# Altium schematic sheet nRF-MCU.SchDoc: =ProjectTitle
size A3; Author: Z. Peterson; Organization: NWES LLC; Address1: 111 SW 5th Ave, STE 3150; Address2: Portland, OR 97204; SheetNumber: 1; SheetTotal: 1
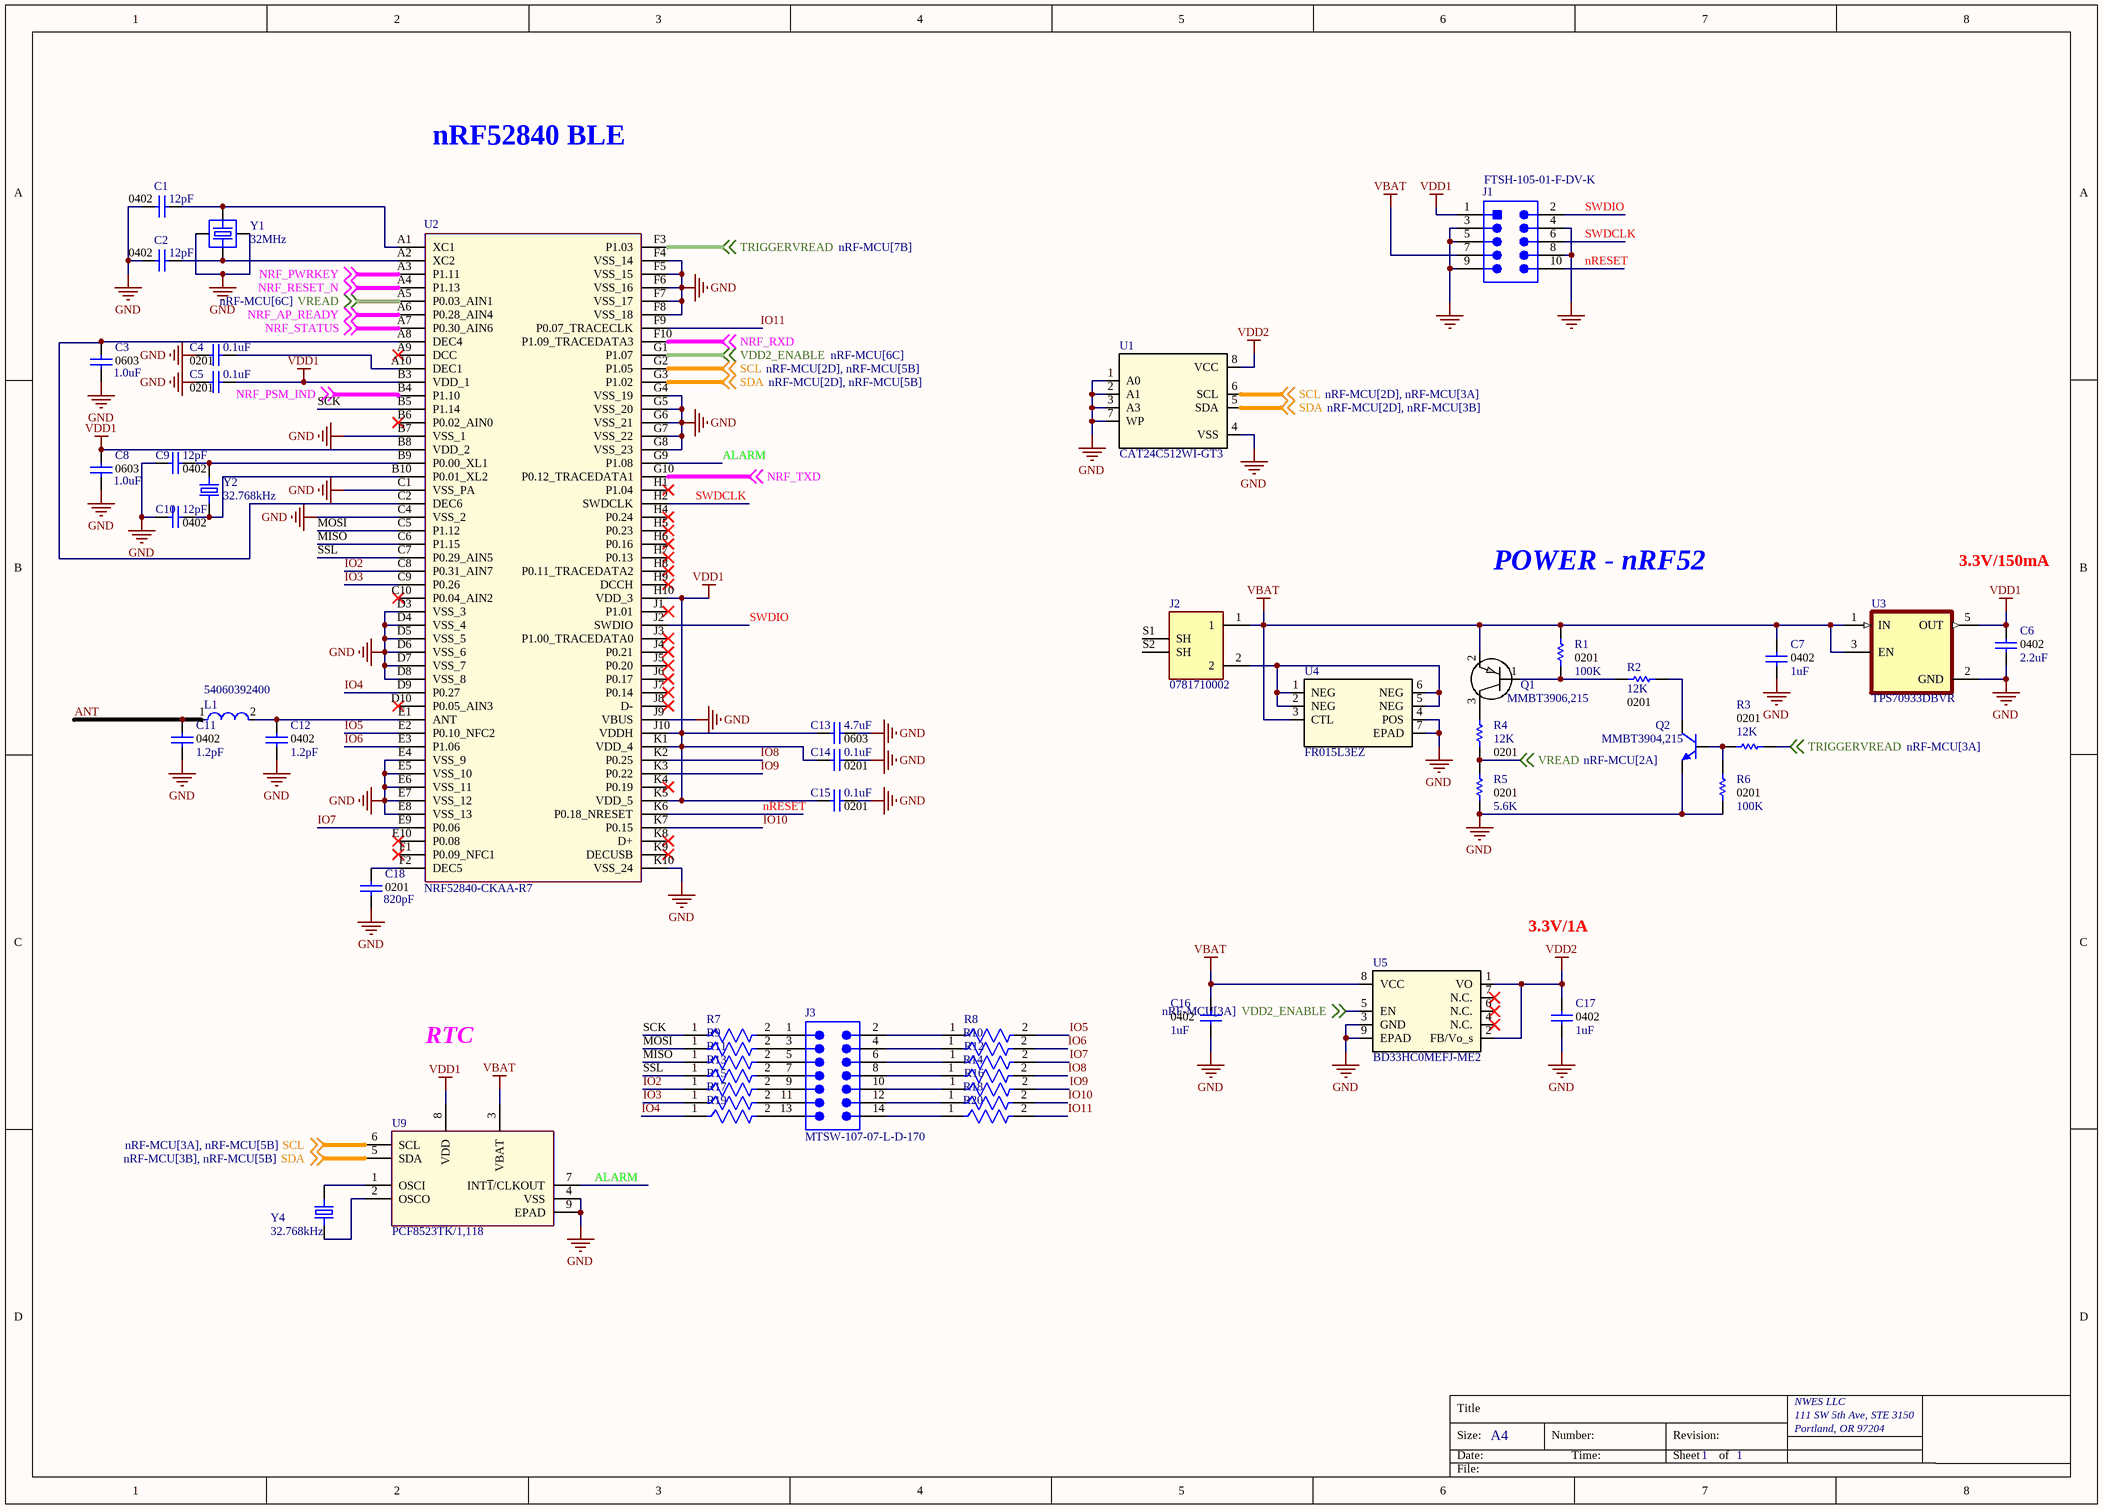
[diagram p0: nRF-MCU.SchDoc]

## Parts
C1  12pF  Package: 0402  [CAPC1005X55USR]
C2  12pF  Package: 0402  [CAPC1005X55USR]
C3  1.0uF  Package: 0603  [CAPC1608]
C4  0.1uF  Package: 0201  [CAPC0603X33N]
C5  0.1uF  Package: 0201  [CAPC0603X33N]
C6  2.2uF  Package: 0402  [CAPC1005X55USR]
C7  1uF  Package: 0402  [CAPC1005X55USR]
C8  1.0uF  Package: 0603  [CAPC1608]
C9  12pF  Package: 0402  [CAPC1005X55USR]
C10  12pF  Package: 0402  [CAPC1005X55USR]
C11  1.2pF  Package: 0402  [CAPC1005X55USR]
C12  1.2pF  Package: 0402  [CAPC1005X55USR]
C13  4.7uF  Package: 0603  [CAPC1608]
C14  0.1uF  Package: 0201  [CAPC0603X33N]
C15  0.1uF  Package: 0201  [CAPC0603X33N]
C16  1uF  Package: 0402  [CAPC1005X55USR]
C17  1uF  Package: 0402  [CAPC1005X55USR]
C18  820pF  Package: 0201  [CAPC0603X33N]
J1  FTSH-105-01-F-DV-K  [SMTC-FTSH-105-01-L-DV-K_V]
J2  0781710002  [MOLEX_0781710002]
J3  MTSW-107-07-L-D-170  [SMTC-MTSW-107-07-X-D-170]
L1  54060392400  [FP-LQW18AN_00-MFG]
Q1  MMBT3906,215  [SOT-23]
Q2  MMBT3904,215  [SOT-23]
R1  100K  Package: 0201  [RESC0603X26N]
R2  12K  Package: 0201  [RESC0603X26N]
R3  12K  Package: 0201  [RESC0603X26N]
R4  12K  Package: 0201  [RESC0603X26N]
R5  5.6K  Package: 0201  [RESC0603X26N]
R6  100K  Package: 0201  [RESC0603X26N]
R7  CRCW040222R0JNED  [FP-CRCW0402-e3-MFG]  (value not drawn)
R8  CRCW040222R0JNED  [FP-CRCW0402-e3-MFG]  (value not drawn)
R9  CRCW040222R0JNED  [FP-CRCW0402-e3-MFG]  (value not drawn)
R10  CRCW040222R0JNED  [FP-CRCW0402-e3-MFG]  (value not drawn)
R11  CRCW040222R0JNED  [FP-CRCW0402-e3-MFG]  (value not drawn)
R12  CRCW040222R0JNED  [FP-CRCW0402-e3-MFG]  (value not drawn)
R13  CRCW040222R0JNED  [FP-CRCW0402-e3-MFG]  (value not drawn)
R14  CRCW040222R0JNED  [FP-CRCW0402-e3-MFG]  (value not drawn)
R15  CRCW040222R0JNED  [FP-CRCW0402-e3-MFG]  (value not drawn)
R16  CRCW040222R0JNED  [FP-CRCW0402-e3-MFG]  (value not drawn)
R17  CRCW040222R0JNED  [FP-CRCW0402-e3-MFG]  (value not drawn)
R18  CRCW040222R0JNED  [FP-CRCW0402-e3-MFG]  (value not drawn)
R19  CRCW040222R0JNED  [FP-CRCW0402-e3-MFG]  (value not drawn)
R20  CRCW040222R0JNED  [FP-CRCW0402-e3-MFG]  (value not drawn)
U1  CAT24C512WI-GT3  [SOIC-8]
U2  NRF52840-CKAA-R7  [BGA94C35P10X10_354X361X51]
U3  TPS70933DBVR  [SOT23-5]
U4  FR015L3EZ  [MLP6_2X2_ONS]
U5  BD33HC0MEFJ-ME2  [HTSOP-J8_ROM]
U9  PCF8523TK/1,118  [HVSON80P400X400X100-9N]
Y1  32MHz  [XTAL_2016_ECS_320]
Y2  32.768kHz  [XTAL_3215]
Y4  32.768kHz  [XTAL_3215]

## Nets
GND: C1.2 C2.2 C3.2 C4.2 C5.2 C6.1 C7.1 C8.2 C9.2 C10.2 C11.1 C12.1 C13.1 C14.1 C15.1 C16.1 C17.1 C18.2 J1.3 J1.4 J1.5 J1.8 J1.9 Q2.2(E) R5.1 R6.1 U1.1(A0) U1.2(A1) U1.3(A3) U1.4(VSS) U1.7(WP) U2.B7(VSS_1) U2.C1(VSS_PA) U2.C4(VSS_2) U2.D3(VSS_3) U2.D4(VSS_4) U2.D5(VSS_5) U2.D6(VSS_6) U2.D7(VSS_7) U2.D8(VSS_8) U2.E4(VSS_9) U2.E5(VSS_10) U2.E6(VSS_11) U2.E7(VSS_12) U2.E8(VSS_13) U2.F4(VSS_14) U2.F5(VSS_15) U2.F6(VSS_16) U2.F7(VSS_17) U2.F8(VSS_18) U2.G4(VSS_19) U2.G5(VSS_20) U2.G6(VSS_21) U2.G7(VSS_22) U2.G8(VSS_23) U2.J9(VBUS) U2.K10(VSS_24) U3.2(GND) U4.4(POS) U4.7(EPAD) U5.3(GND) U5.9(EPAD) U9.4(VSS) U9.9(EPAD) Y1.2(GND) Y1.4(GND)
VBAT: C7.2 C16.2 J1.7 J2.1 Q1.2(E) R1.2 U3.1(IN) U3.3(EN) U4.3(CTL) U5.8(VCC) U9.3(VBAT)
VDD1: C5.1 C6.2 C8.1 C13.2 C14.2 C15.2 J1.1 U2.B3(VDD_1) U2.B8(VDD_2) U2.H10(VDD_3) U2.J10(VDDH) U2.K1(VDD_4) U2.K5(VDD_5) U3.5(OUT) U9.8(VDD)
VDD2: C17.2 U1.8(VCC) U5.1(VO) U5.2(FB/Vo_s)
ALARM: U2.G9(P1.08) U9.7(INT~{1}/CLKOUT)
ANT: C11.2 L1.1
IO2: R15.1 U2.C8(P0.31_AIN7)
IO3: R17.1 U2.C9(P0.26)
IO4: R19.1 U2.D9(P0.27)
IO5: R8.2 U2.E2(P0.10_NFC2)
IO6: R10.2 U2.E3(P1.06)
IO7: R12.2 U2.E9(P0.06)
IO8: R14.2 U2.K2(P0.25)
IO9: R16.2 U2.K3(P0.22)
IO10: R18.2 U2.K7(P0.15)
IO11: R20.2 U2.F9(P0.07_TRACECLK)
MISO: R11.1 U2.C6(P1.15)
MOSI: R9.1 U2.C5(P1.12)
nRESET: J1.10 U2.K6(P0.18_NRESET)
NRF_AP_READY: U2.A6(P0.28_AIN4) ; off-sheet NRF_AP_READY
NRF_PSM_IND: U2.B4(P1.10) ; off-sheet NRF_PSM_IND
NRF_PWRKEY: U2.A3(P1.11) ; off-sheet NRF_PWRKEY
NRF_RESET_N: U2.A4(P1.13) ; off-sheet NRF_RESET_N
NRF_RXD: U2.F10(P1.09_TRACEDATA3) ; off-sheet NRF_RXD
NRF_STATUS: U2.A7(P0.30_AIN6) ; off-sheet NRF_STATUS
NRF_TXD: U2.G10(P0.12_TRACEDATA1) ; off-sheet NRF_TXD
SCK: R7.1 U2.B5(P1.14)
SCL: U1.6(SCL) U2.G2(P1.05) U9.6(SCL) ; off-sheet SCL
SDA: U1.5(SDA) U2.G3(P1.02) U9.5(SDA) ; off-sheet SDA
SSL: R13.1 U2.C7(P0.29_AIN5)
SWDCLK: J1.6 U2.H2(SWDCLK)
SWDIO: J1.2 U2.J2(SWDIO)
TRIGGERVREAD: R3.1 U2.F3(P1.03) ; off-sheet TRIGGERVREAD
VDD2_ENABLE: U2.G1(P1.07) U5.5(EN) ; off-sheet VDD2_ENABLE
VREAD: R4.2 R5.2 U2.A5(P0.03_AIN1) ; off-sheet VREAD
NetC1_1: C1.1 U2.A1(XC1) Y1.1(I/O)
NetC2_1: C2.1 U2.A2(XC2) Y1.3(O/I)
NetC3_1: C3.1 U2.A8(DEC4) U2.C2(DEC6)
NetC4_1: C4.1 U2.A10(DEC1)
NetC9_1: C9.1 U2.B9(P0.00_XL1) Y2.2(O/I)
NetC10_1: C10.1 U2.B10(P0.01_XL2) Y2.1(I/O)
NetC12_2: C12.2 L1.2 U2.E1(ANT)
NetC18_1: C18.1 U2.F2(DEC5)
NetJ2_2: J2.2 U4.1(NEG) U4.2(NEG) U4.5(NEG) U4.6(NEG)
NetJ3_1: J3.1 R7.2
NetJ3_2: J3.2 R8.1
NetJ3_3: J3.3 R9.2
NetJ3_4: J3.4 R10.1
NetJ3_5: J3.5 R11.2
NetJ3_6: J3.6 R12.1
NetJ3_7: J3.7 R13.2
NetJ3_8: J3.8 R14.1
NetJ3_9: J3.9 R15.2
NetJ3_10: J3.10 R16.1
NetJ3_11: J3.11 R17.2
NetJ3_12: J3.12 R18.1
NetJ3_13: J3.13 R19.2
NetJ3_14: J3.14 R20.1
NetQ1_1: Q1.1(B) R1.1 R2.2
NetQ1_3: Q1.3(C) R4.1
NetQ2_1: Q2.1(B) R3.2 R6.2
NetQ2_3: Q2.3(C) R2.1
NetU9_1: U9.1(OSCI) Y4.2(O/I)
NetU9_2: U9.2(OSCO) Y4.1(I/O)

Not connected (* = marked no-connect by the designer): J2 S1(SH) S2(SH); U2 A9(DCC)* B6(P0.02_AIN0)* C10(P0.04_AIN2)* D10(P0.05_AIN3)* E10(P0.08)* F1(P0.09_NFC1)* H1(P1.04)* H4(P0.24)* H5(P0.23)* H6(P0.16)* H7(P0.13)* H8(P0.11_TRACEDATA2)* H9(DCCH)* J1(P1.01)* J3(P1.00_TRACEDATA0)* J4(P0.21)* J5(P0.20)* J6(P0.17)* J7(P0.14)* J8(D-)* K4(P0.19)* K8(D+)* K9(DECUSB)*; U5 4(N.C.)* 6(N.C.)* 7(N.C.)*

## Notes on the sheet
- nRF52840 BLE
- POWER - nRF52
- 3.3V/150mA
- 3.3V/1A
- RTC
- Title
- Size:
- Date:
- A4
- Number:
- Time:
- Revision:
- Sheet
- of
- File:

## Library data of the parts
C1 C2 C9 C10 = CAP CER 12PF 50V C0G/NP0 0402: Manufacturer Part Number: CC0402GRNPO9BN120; Manufacturer: YAGEO; Supplier Part Number 1: 311-3609-1-ND; Height: 0.55mm; Supplier 1: Digi-Key; value: 12pF
C3 C8 = CAP CER 1UF 16V X7R 0603: Manufacturer Part Number: C0603C105K4RAC7867; Manufacturer: KEMET; Supplier Part Number 1: 399-C0603C105K4RAC7867CT-ND; Height: 0.9mm; Supplier 1: Digi-Key; value: 1.0uF
C4 C5 C14 C15 = CAP CER 0.1UF 6.3V X7R 0201: Manufacturer Part Number: CC0201KRX7R5BB104; Manufacturer: YAGEO; Supplier Part Number 1: 13-CC0201KRX7R5BB104CT-ND; Height: 0.33mm; Supplier 1: Digi-Key; value: 0.1uF
C6 = CAP CER 2.2UF 25V X5R 0402: Manufacturer Part Number: GRM155R61E225ME15D; Manufacturer: Murata Electronics; Supplier Part Number 1: 490-10457-1-ND; Height: 0.55mm; Supplier 1: Digi-Key; value: 2.2uF
C7 C16 C17 = CAP CER 1UF 25V X5R 0402: Manufacturer Part Number: GRM155C81E105ME11J; Manufacturer: Murata Electronics; Supplier Part Number 1: 490-GRM155C81E105ME11JCT-ND; Height: 0.6mm; Supplier 1: Digi-Key; value: 1uF
C11 C12 = CAP CER 1.2PF 50V C0G/NP0 0402: Manufacturer Part Number: GCM1555C1H1R2BA16D; Manufacturer: Murata Electronics; Supplier Part Number 1: 490-16453-1-ND; Height: 0.55mm; Supplier 1: Digi-Key; value: 1.2pF
C13 = CAP CER 4.7UF 6.3V X7R 0603: Manufacturer Part Number: JMK107BB7475KA-T; Manufacturer: Taiyo Yuden; Supplier Part Number 1: 587-5870-1-ND; Height: 1.0mm; Supplier 1: Digi-Key; value: 4.7uF
C18 = CAP CER 820PF 25V X7R 0201: Manufacturer Part Number: CC0201KRX7R8BB821; Manufacturer: YAGEO; Supplier Part Number 1: 311-3698-1-ND; Height: 0.33mm; Supplier 1: Digi-Key; value: 820pF
J1 = CMP-2000-05352-1: Male Header, Pitch 1.27 mm, 2 x 5 Position, Height 6.12 mm, RoHS, Tube; Manufacturer: Samtec; Number of Positions: 10; Connector Type: Header,Shrouded; Number of Positions Loaded: All; Row Spacing: 0.050"(1.27mm); Fastening Type: -; Package Reference: FTSH-105-01-L-DV-K; Termination: Solder; Package URL: http://suddendocs.samtec.com/prints/ftsh-1xx-xx-xxx-dv-xxx-footprint.pdf; Number of Rows: 2; Contact Finish Thickness: 3µin(0.08µm); Contact Type: MalePin; Manufacturer URL: http://www.samtec.com/; Contact Mating Length: 0.120"(3.05mm); Pitch: 0.050"(1.27mm); Series: FTSH; Features: -; Contact Finish: Gold; Color: Black; Family: RectangularConnectors-Headers,MalePins; Datasheet URL: http://suddendocs.samtec.com/prints/ftsh-1xx-xx-xxx-dv-xxx-mkt.pdf; Package Description: Male Header, Pitch 1.27 mm, 2 x 5 Position, Height 5.97 mm, Tail Length 4.32 mm; Mounting Type: SurfaceMount; Datasheet Version: Rev. ET, 10/1995; Category: Connectors,Interconnects; Packaging: Tube
J2 = CONN_0781710002: Pico-EZmate Wire-to-Board Header Vertical Housing Height 1.55mm with Side Friction Locks 2 Circuits; Manufacturer: Molex; Contact Resistance: 20mR; Number of Positions: 2; Max Voltage Rating (DC): 50V; Connector Type: Plug; Pitch: 1.2mm; Supplier 1: Digi-Key; Manufacturer Part Number: 0781710002; RoHS: Yes; Category: Headers and Wire Housings; Stock 1: 156886; Pricing 1: 1=0.40000, 10=0.32600, 100=0.23890, 1000=0.19000 (USD); Mount: Surface Mount; Contact Plating: Gold; Contact Material: Copper Alloy; Housing Material: Polymer; Color: Black; Housing Color: Black; Min Operating Temperature: -25°C; Max Operating Temperature: 85°C; Number of Rows: 1; Packaging: Tape and Reel; Termination: Solder; Number of Contacts: 2; Orientation: Straight; Series: Pico-EZmate™ 78171; Fastening Type: Friction; Max Voltage Rating (AC): 50V; Contact Type: Tab; Length: 4.2mm; Depth: 4.5mm; Radiation Hardening: No; RoHS Compliant: Yes; ComponentLink1URL: https://datasheet.ciiva.com/738/781710002-sd-738384.pdf?src-supplier=Digi-Key; ComponentLink1Description: https://datasheet.ciiva.com/738/781710002-sd-738384.pdf?src-supplier=Digi-Key; ComponentLink2URL: https://datasheet.ciiva.com/738/781710002-sd-738387.pdf?src-supplier=Digi-Key; ComponentLink2Description: https://datasheet.ciiva.com/738/781710002-sd-738387.pdf?src-supplier=Digi-Key; ComponentLink3URL: https://datasheet.ciiva.com/738/781710002-sd-738390.pdf?src-supplier=Digi-Key; ComponentLink3Description: https://datasheet.ciiva.com/738/781710002-sd-738390.pdf?src-supplier=Digi-Key; Supplier Part Number 1: WM4459CT-ND
J3 = CMP-1024-00128-1: Modified .025" SQ Post Header, Through-hole, Vertical, -55 to 125 degC, 2.54 mm Pitch, 14-Pin, Male, RoHS; Manufacturer: Samtec; Pitch: 2.54 mm; Temperature Range: -55 to 125 degC; ComponentLink3URL: http://www.samtec.com/documents/webfiles/cpdf/MTSW-XXX-XX-X-X-XXXX-XX-XXX-MKT1.pdf; PartNumber: MTSW-107-07-L-D-170; DatasheetVersion: F-214; ComponentLink2URL: http://www.samtec.com/documents/webfiles/pdf/MTSW.PDF; Orientation: Vertical; RoHS: True; ComponentLink3Description: Package Specification; PackageVersion: BI, 2/1987; PackageDescription: Assembly .025" [.64] SQ Post Terminal Strip; ComponentLink1URL: http://www.samtec.com; PackageReference: MTSW-107-07-X-D-170; Mounting Technology: Through-hole; ComponentLink1Description: Manufacturer URL; ComponentLink2Description: Datasheet
L1 = CMP-06042-012062-1: Fixed Inductors RF Chip Inductor SMD 3.9nH 0603 10% Tol; Manufacturer: Sumida; Q Factor: 35; Max DC Current: 750mA; Self Resonant Frequency: 6GHz; Current: 200mA; Shielding: Unshielded; Tolerance: 2%; Core Material: Non-Magnetic; Test Frequency: 100MHz; Series Resistance: 35mR; DC Resistance (DCR): 82mR; Lead Free: Lead Free; Radiation Hardening: No; Military Standard: Not; Min Operating Temperature: -55°C; Current Rating: 750mA; Max Operating Temperature: 125°C; Weight: 0.000106oz; Case Code (Metric): 1608; Resistor Type: Wirewound; Package Quantity: 4000; Case/Package: 0603; Length: 1.6mm; Depth: 1mm; Packaging: Tape and Reel; Mount: Surface Mount; Height - Seated (Max): 0.039inch; Width: 0.031inch; Case Code (Imperial): 0603; Inductance: 3.9nH; DC Current: 750mA; Termination: SMD/SMT; Height: 0.8mm; Manufacturer Part  Number: 54060392400
Q1 = PNP_MMBT3906,215: TRANS PNP 40V 0.2A TO236AB; Manufacturer: Nexperia; Supplier 1: Digi-Key; Manufacturer Part Number: MMBT3906,215; RoHS: Yes; Category: BJTs; Stock 1: 1789; Pricing 1: 1=0.14000, 10=0.12800, 100=0.06970, 500=0.04290, 1000=0.02926 (USD); RoHS Compliant: Yes; ComponentLink1URL: http://www.farnell.com/datasheets/454048.pdf?src-supplier=Farnell; ComponentLink1Description: http://www.farnell.com/datasheets/454048.pdf?src-supplier=Farnell; ComponentLink2URL: https://assets.nexperia.com/documents/data-sheet/MMBT3906.pdf?src-supplier=Digi-Key; ComponentLink2Description: https://assets.nexperia.com/documents/data-sheet/MMBT3906.pdf?src-supplier=Digi-Key; ComponentLink3URL: http://www.nxp.com/packings/SOT23_215.html?src-supplier=Farnell; ComponentLink3Description: http://www.nxp.com/packings/SOT23_215.html?src-supplier=Farnell; Supplier Part Number 1: 1727-4045-1-ND
Q2 = NPN_MMBT3904,215: TRANS NPN 40V 0.2A SOT23; Manufacturer: Nexperia; Supplier 1: Digi-Key; Manufacturer Part Number: MMBT3904,215; RoHS: Yes; Category: BJTs; Stock 1: 1634308; Pricing 1: 1=0.13000, 10=0.11800, 100=0.06440, 500=0.03964, 1000=0.02703 (USD); RoHS Compliant: Yes; ComponentLink1URL: http://www.farnell.com/datasheets/2328888.pdf?src-supplier=Farnell; ComponentLink1Description: http://www.farnell.com/datasheets/2328888.pdf?src-supplier=Farnell; ComponentLink2URL: https://assets.nexperia.com/documents/data-sheet/MMBT3904.pdf?src-supplier=Digi-Key; ComponentLink2Description: https://assets.nexperia.com/documents/data-sheet/MMBT3904.pdf?src-supplier=Digi-Key; ComponentLink3URL: http://www.farnell.com/datasheets/2328888.pdf?src-supplier=Newark; ComponentLink3Description: http://www.farnell.com/datasheets/2328888.pdf?src-supplier=Newark; Supplier Part Number 1: 1727-4044-1-ND
R1 R6 = RES 100K OHM 1% 1/20W 0201: Manufacturer: Yageo; Manufacturer Part Number: RC0201FR-07100KL; Supplier Part Number 1: 311-100KMCT-ND; Height: 0.26mm; Supplier 1: Digi-Key; value: 100K
R2-R4 = RES 12K OHM 1% 1/20W 0201: Manufacturer: Yageo; Manufacturer Part Number: RC0201FR-0712KL; Supplier Part Number 1: 311-12.0KMCT-ND; Height: 0.26mm; Supplier 1: Digi-Key; value: 12K
R5 = RES 5.6K OHM 1% 1/20W 0201: Manufacturer: Yageo; Manufacturer Part Number: RC0201FR-075K6L; Supplier Part Number 1: YAG2346CT-ND; Height: 0.26mm; Supplier 1: Digi-Key; value: 5.6K
R7-R20 = CMP-1011-00034-3: RES Thick Film, 22Ω, 5%, 0.063W, 200ppm/°C, 0402; Power Rating: 63mW; Voltage Rating: 50V; Resistance: 22R; Min Operating Temperature: -55°C; Packaging: Tape and Reel; Depth: 0.5mm; Width: 0.5mm; Composition: Thick Film; Height: 0.016inch; Max Operating Temperature: 155°C; Number of Pins: 2; Length: 1mm; Temperature Coefficient: 200ppm/°C; Termination: SMD/SMT; Tolerance: 5%; Case/Package: 0402; Weight: 2.3E-05oz; Contact Plating: Tin; Number of Terminations: 2; Package Quantity: 1; Military Standard: Not; Features: Automotive AEC-Q200; Max Power Dissipation: 63mW; Case Code (Metric): 1005; Case Code (Imperial): 0402
U1 = CAT24C512WI-GT3: IC EEPROM 512KBIT 1MHZ 8SOIC; Manufacturer: ON Semiconductor; Frequency: 100kHz; Max Supply Voltage: 5.5V; Min Supply Voltage: 1.8V; Nominal Supply Current: 2.5mA; Interface: I2C,Serial,2-Wire; Access Time: 3500ns; Density: 512Kb; Max Frequency: 400kHz; Organization: 32KX8; Access Time-Max: 900ns; Write Protection: YES; Number of Words: 64000; Operating Supply Voltage: 5V; Write Cycle Time-Max (tWC): 5ms; Supplier 1: Mouser; Manufacturer Part Number: CAT24C512WI-GT3; RoHS: Yes; Category: EEPROM; Stock 1: 254725; Pricing 1: 1=0.68000, 10=0.62300, 50=0.61200, 100=0.54700, 1000=0.51600, 10000=0.50800 (USD); Mount: Surface Mount; Case/Package: SOIC; Number of Pins: 8; Contact Plating: Gold; Min Operating Temperature: -40°C; Max Operating Temperature: 85°C; Packaging: Tape and Reel; Package Quantity: 1; Memory Type: EEPROM; Series: -; Supply Current: 2.5mA; Radiation Hardening: No; Lead Free: Lead Free; RoHS Compliant: Yes; ComponentLink1URL: https://datasheet.ciiva.com/22618/1674429-22618480.pdf?src-supplier=Element14; ComponentLink1Description: https://datasheet.ciiva.com/22618/1674429-22618480.pdf?src-supplier=Element14; Supplier Part Number 1: 863-CAT24C512WI-GT3; Memory Size: 512Kb; Supply Voltage-Nom: 5.5V; Length: 5mm; Width: 4mm; Height: 1.5mm; REACH SVHC: No SVHC; Halogen Free: Halogen Free; ComponentLink2URL: https://datasheet.ciiva.com/25627/0900766b810de298-25627756.pdf?src-supplier=RSComponents; ComponentLink2Description: https://datasheet.ciiva.com/25627/0900766b810de298-25627756.pdf?src-supplier=RSComponents
U2 = NRF52840-CKAA-R7: Advanced Bluetooth 5, Thread and Zigbee multiprotocol SoC; Manufacturer: Nordic Semiconductor; Supplier 1: Mouser; Manufacturer Part Number: NRF52840-CKAA-R7; RoHS: Yes; Category: RF Receivers, Transceivers; Pricing 1: 1=6.69000, 10=6.04000, 50=5.76000, 100=5.00000, 1000=5.00000, 10000=5.00000 (USD); Supplier Part Number 1: 949-NRF52840-CKAA-R7
U3 = TPS70933DBVR: Linear Voltage Regulator IC Positive Fixed 1 Output 3.3V 150mA SOT-23-5; Manufacturer: Texas Instruments; Dropout Voltage: 960mV; Number of Outputs: 1; Min Input Voltage: 2.7V; Max Input Voltage: 30V; Min Current Limit: 200mA; Output Voltage Accuracy: 1%; Accuracy: 2%; Power Supply Rejection Ratio (PSRR): 80dB; Quiescent Current: 1uA; Supplier 1: Digi-Key; Manufacturer Part Number: TPS70933DBVR; RoHS: Yes; Category: Voltage Regulators - Linear; Stock 1: 84982; Pricing 1: 1=1.37000, 10=1.22300, 25=1.16040, 100=0.95330, 250=0.89108, 500=0.78748, 1000=0.62560 (USD); Mount: Surface Mount; Case/Package: SOT-23-5; Number of Pins: 5; Min Operating Temperature: -40°C; Max Operating Temperature: 125°C; Packaging: Tape and Reel; Output Voltage: 3.3V; Output Current: 150mA; Package Quantity: 1; Max Output Current: 150mA; Number of Regulators: 1; Polarity: Positive; Nominal Output Voltage: 3.3V; Output Type: Fixed; Series: -; Radiation Hardening: No; REACH SVHC: No SVHC; Lead Free: Lead Free; RoHS Compliant: Yes; ComponentLink1URL: https://datasheet.ciiva.com/6580/tps70933-6580912.pdf?src-supplier=Digi-Key; ComponentLink1Description: https://datasheet.ciiva.com/6580/tps70933-6580912.pdf?src-supplier=Digi-Key; ComponentLink2URL: https://datasheet.ciiva.com/6580/tps709-6580908.pdf?src-supplier=Digi-Key; ComponentLink2Description: https://datasheet.ciiva.com/6580/tps709-6580908.pdf?src-supplier=Digi-Key; ComponentLink3URL: https://datasheet.ciiva.com/6580/tps709-6580911.pdf?src-supplier=Digi-Key; ComponentLink3Description: https://datasheet.ciiva.com/6580/tps709-6580911.pdf?src-supplier=Digi-Key; Supplier Part Number 1: 296-35483-1-ND
U4 = FR015L3EZ: LOW SIDE REV BIAS POLAR PROTECT; Manufacturer: ON Semiconductor / Fairchild; Operating Supply Voltage: 8V; Clamping Voltage: 15V; Number of Circuits: 1; Breakdown Voltage: 14.5V; Polarity: Unidirectional; Peak Pulse Power: 2.4W; Voltage: 1.3V; Current: 8A; Supplier 1: Mouser; Manufacturer Part Number: FR015L3EZ; RoHS: Yes; Category: EMI / RFI Components; Stock 1: 21380; Pricing 1: 1=0.71000, 10=0.62700, 50=0.62700, 100=0.48000, 1000=0.30400, 10000=0.26700 (USD); Mount: Surface Mount; Number of Pins: 6; Weight: 0.03g; Min Operating Temperature: -55°C; Max Operating Temperature: 125°C; Packaging: Tape and Reel; Package Quantity: 3000; Working Voltage: 8V; Number of Channels: 1; Termination: SMD/SMT; Series: FR015; Number of Outputs: 1; Max Power Dissipation: 2.4W; Length: 2mm; Width: 2mm; Height: 0.725mm; Lead Free: Lead Free; RoHS Compliant: Yes; ComponentLink1URL: https://datasheet.ciiva.com/13084/fr015l3ez-113107-13084211.pdf?src-supplier=Mouser; ComponentLink1Description: https://datasheet.ciiva.com/13084/fr015l3ez-113107-13084211.pdf?src-supplier=Mouser; ComponentLink2URL: https://datasheet.ciiva.com/6702/fr015l3ez-6702465.pdf?src-supplier=Digi-Key; ComponentLink2Description: https://datasheet.ciiva.com/6702/fr015l3ez-6702465.pdf?src-supplier=Digi-Key; Supplier Part Number 1: 512-FR015L3EZ
U5 = BD33HC0MEFJ-ME2: LDO Regulator Pos 3.3V 1A Automotive 8-Pin HTSOP-J EP T/R; Manufacturer: Rohm; Dropout Voltage: 600mV; Number of Outputs: 1; Min Input Voltage: 4.5V; Max Input Voltage: 8V; Max Power Dissipation: 2.11W; Input Bias Current: 600uA; Output Type: Fixed; Supplier 1: Digi-Key; Manufacturer Part Number: BD33HC0MEFJ-ME2; RoHS: Yes; Category: Voltage Regulators - Linear; Stock 1: 1946; Pricing 1: 1=1.50000, 10=1.34500, 25=1.27640, 100=1.04830, 250=0.97996, 500=0.86602, 1000=0.68370 (USD); Mount: Surface Mount; Number of Pins: 8; Min Operating Temperature: -40°C; Max Operating Temperature: 105°C; Package Quantity: 1; Packaging: Tape and Reel; Max Output Current: 1A; Output Voltage: 3.3V; Output Current: 1A; Number of Regulators: 1; Nominal Output Voltage: 3.3V; REACH SVHC: Unknown; RoHS Compliant: Yes; ComponentLink1URL: https://datasheet.ciiva.com/29568/bdxxhc0mefj-m-e-29568538.pdf?src-supplier=Digi-Key; ComponentLink1Description: https://datasheet.ciiva.com/29568/bdxxhc0mefj-m-e-29568538.pdf?src-supplier=Digi-Key; ComponentLink2URL: https://datasheet.ciiva.com/29568/bdxxhc0mefj-m-e-29568539.pdf?src-supplier=Digi-Key; ComponentLink2Description: https://datasheet.ciiva.com/29568/bdxxhc0mefj-m-e-29568539.pdf?src-supplier=Digi-Key; ComponentLink3URL: https://datasheet.ciiva.com/29569/bdxxhc0mefj-m-e-29569161.pdf?src-supplier=Digi-Key; ComponentLink3Description: https://datasheet.ciiva.com/29569/bdxxhc0mefj-m-e-29569161.pdf?src-supplier=Digi-Key; ComponentLink4URL: https://datasheet.ciiva.com/48677/bdxxhc0mefj-m-e-48677678.pdf?src-supplier=Avnet; ComponentLink4Description: https://datasheet.ciiva.com/48677/bdxxhc0mefj-m-e-48677678.pdf?src-supplier=Avnet; Supplier Part Number 1: BD33HC0MEFJ-ME2CT-ND
U9 = PCF8523TK/1,118: PCF8523 Series 5.5 V 1 Mbps I2C Interface Real Time Clock / Calendar - HVSON-8; Manufacturer: NXP Semiconductors; Max Supply Voltage: 5.5V; Min Supply Voltage: 1.2V; Time Format: HH:MM:SS; Supplier 1: Digi-Key; Manufacturer Part Number: PCF8523TK/1,118; RoHS: Yes; Category: Real Time Clocks; Stock 1: 85182; Pricing 1: 1=1.91000, 10=1.71600, 25=1.61920, 100=1.37950, 250=1.29528, 500=1.13336, 1000=1.02389 (USD); Mount: Surface Mount; Case/Package: HVSON; Number of Pins: 8; Min Operating Temperature: -40°C; Max Operating Temperature: 85°C; Packaging: Tape and Reel; Interface: I2C; Package Quantity: 6000; Logic Function: Clock; Supply Voltage-Nom: 5.5V; Radiation Hardening: No; REACH SVHC: No SVHC; Lead Free: Lead Free; Temperature Grade: INDUSTRIAL; RoHS Compliant: Yes; ComponentLink1URL: https://datasheet.ciiva.com/1238/pcf8523-1238777.pdf?src-supplier=Digi-Key; ComponentLink1Description: https://datasheet.ciiva.com/1238/pcf8523-1238777.pdf?src-supplier=Digi-Key; ComponentLink2URL: https://datasheet.ciiva.com/1238/pcf8523-1238778.pdf?src-supplier=Digi-Key; ComponentLink2Description: https://datasheet.ciiva.com/1238/pcf8523-1238778.pdf?src-supplier=Digi-Key; ComponentLink3URL: https://datasheet.ciiva.com/1238/pcf8523-1238779.pdf?src-supplier=Digi-Key; ComponentLink3Description: https://datasheet.ciiva.com/1238/pcf8523-1238779.pdf?src-supplier=Digi-Key; ComponentLink4URL: https://datasheet.ciiva.com/8144/pcf8523-8144533.pdf?src-supplier=Avnet; ComponentLink4Description: https://datasheet.ciiva.com/8144/pcf8523-8144533.pdf?src-supplier=Avnet; ComponentLink5URL: https://datasheet.ciiva.com/16355/pcf8523-16355845.pdf?src-supplier=Future+Electronics; ComponentLink5Description: https://datasheet.ciiva.com/16355/pcf8523-16355845.pdf?src-supplier=Future+Electronics; Supplier Part Number 1: 568-6648-1-ND
Y1 = XTAL_ECS-320-8-37BQ-CKY-TR: Crystal 32MHz 8pF ±10ppm ±10ppm 4-Pin Miniature CSMD T/R; Manufacturer: ECS International; Supplier 1: Digi-Key; Manufacturer Part Number: ECS-320-8-37BQ-CKY-TR; RoHS: No; Stock 1: 8978; Pricing 1: 1=0.57000, 10=0.47700, 50=0.42960, 100=0.38180, 500=0.36270 (USD); Supplier Part Number 1: 50-ECS-320-8-37BQ-CKY-CT-ND
Y2 = XTAL_ABS07-32.768KHZ-9-1-T: ABS07 Series 3.2 x 1.5 x 0.9 mm 32.768 KHz ±10ppm 9 pF -40 to 85°C Crystal SMT; Manufacturer: Abracon; Load Capacitance: 9pF; ESR (Equivalent Series Resistance): 70kR; Supplier 1: Mouser; Manufacturer Part Number: ABS07-32.768KHZ-9-1-T; RoHS: Yes; Category: Crystals; Stock 1: 54228; Pricing 1: 1=1.50000, 10=1.44000, 50=1.40000, 100=1.20000, 1000=0.98500, 10000=0.90100 (USD); Mount: Surface Mount; Case/Package: SMD/SMT; Min Operating Temperature: -40°C; Max Operating Temperature: 85°C; Package Quantity: 3000; Frequency: 32.768kHz; Frequency Tolerance: 10ppm; Packaging: Tape and Reel; Length: 0.126inch; Width: 0.061inch; Height: 0.035inch; Lead Free: Lead Free; RoHS Compliant: Yes; ComponentLink1URL: https://datasheet.ciiva.com/12389/abs07-11028-12389874.pdf?src-supplier=Mouser; ComponentLink1Description: https://datasheet.ciiva.com/12389/abs07-11028-12389874.pdf?src-supplier=Mouser; Supplier Part Number 1: 815-ABS07-32.7K9-1-T; Tolerance: 10ppm; Termination: SMD/SMT; Series: ABS07; Operating Frequency: 32.768 kHz
Y4 = XTAL_ABS07-32.768KHZ-7-T: Crystal 0.032768MHz ±20ppm (Tol) 7pF Flexural 70000Ohm 2-Pin CSMD T/R; Manufacturer: Abracon; ESR (Equivalent Series Resistance): 70kR; Insulation Resistance: 500MR; Supplier 1: Digi-Key; Manufacturer Part Number: ABS07-32.768KHZ-7-T; RoHS: Yes; Category: Crystals; Stock 1: 994435; Pricing 1: 1=1.50000, 10=1.43600, 50=1.40240, 100=1.20200, 500=1.16864, 1000=0.98500 (USD); Mount: Surface Mount; Case/Package: CSMD; Number of Pins: 2; Min Operating Temperature: -40°C; Max Operating Temperature: 85°C; Package Quantity: 3000; Frequency: 32.768kHz; Frequency Tolerance: 20ppm; Load Capacitance: 7pF; Packaging: Tape and Reel; Length: 3.2mm; Width: 1.5mm; Height: 0.035inch; Lead Free: Lead Free; ComponentLink1URL: https://datasheet.ciiva.com/3174/abs07-3174144.pdf?src-supplier=Avnet; ComponentLink1Description: https://datasheet.ciiva.com/3174/abs07-3174144.pdf?src-supplier=Avnet; ComponentLink2URL: https://datasheet.ciiva.com/855/abs07-855945.pdf?src-supplier=Digi-Key; ComponentLink2Description: https://datasheet.ciiva.com/855/abs07-855945.pdf?src-supplier=Digi-Key; ComponentLink3URL: https://datasheet.ciiva.com/855/abs07-855946.pdf?src-supplier=Digi-Key; ComponentLink3Description: https://datasheet.ciiva.com/855/abs07-855946.pdf?src-supplier=Digi-Key; Supplier Part Number 1: 535-9543-1-ND; Tolerance: 20ppm; Frequency Stability: 20ppm; Termination: SMD/SMT; Series Resistance: 70kR; Series: ABS07; Operating Frequency: 32.768 kHz; Depth: 1.5mm; Radiation Hardening: No; REACH SVHC: No SVHC; ComponentLink4URL: https://datasheet.ciiva.com/855/abs07-855947.pdf?src-supplier=Digi-Key; ComponentLink4Description: https://datasheet.ciiva.com/855/abs07-855947.pdf?src-supplier=Digi-Key; ComponentLink5URL: https://datasheet.ciiva.com/8344/abs07-8344589.pdf?src-supplier=Avnet; ComponentLink5Description: https://datasheet.ciiva.com/8344/abs07-8344589.pdf?src-supplier=Avnet; ComponentLink6URL: https://datasheet.ciiva.com/16199/abs07-16199467.pdf?src-supplier=Future+Electronics; ComponentLink6Description: https://datasheet.ciiva.com/16199/abs07-16199467.pdf?src-supplier=Future+Electronics